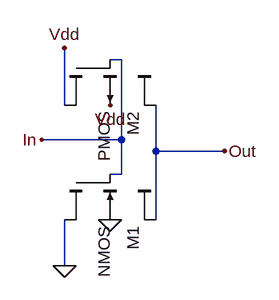
[diagram p0: schematic inverterLVS.asc]
inverterLVS.asc, the LTspice schematic file:
Version 4
SHEET 1 880 680
WIRE 224 16 208 16
WIRE 144 80 144 0
WIRE 224 128 224 16
WIRE 224 128 112 128
WIRE 272 144 272 80
WIRE 368 144 272 144
WIRE 224 176 224 128
WIRE 224 176 208 176
WIRE 272 240 272 144
WIRE 144 304 144 240
FLAG 208 240 0
FLAG 208 80 Vdd
FLAG 144 304 0
FLAG 144 0 Vdd
FLAG 112 128 In
FLAG 368 144 Out
SYMBOL cktsym\\nmos4 208 240 R90
SYMATTR InstName M1
SYMATTR Value2 l=.9u w=3u
SYMBOL cktsym\\pmos4 208 80 R90
SYMATTR InstName M2
SYMATTR Value2 l=.9u w=6u

The netlist it stands for:
* inverterLVS.asc
M1 Out In 0 0 NMOS l=.9u w=3u
M2 Vdd In Out Vdd PMOS l=.9u w=6u
.model NMOS NMOS
.model PMOS PMOS
.lib standard.mos
.backanno
.end